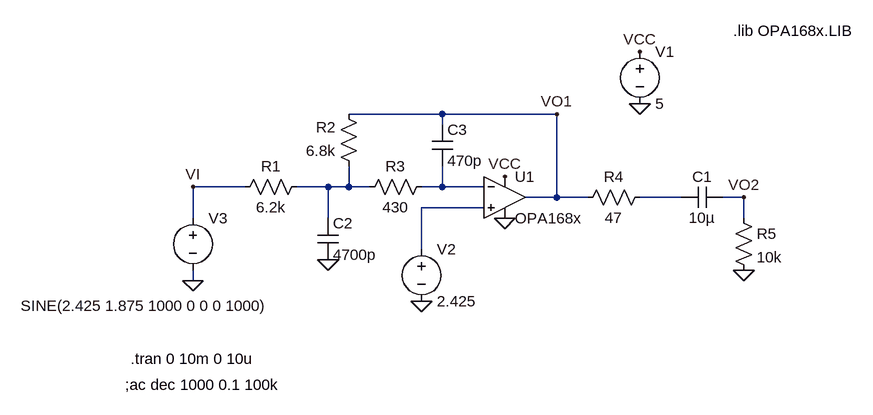
[diagram p0: schematic DACFilter.asc]
DACFilter.asc, the LTspice schematic file:
Version 4
SHEET 1 880 680
WIRE 112 32 -32 32
WIRE 288 32 112 32
WIRE 112 48 112 32
WIRE -192 144 -272 144
WIRE -64 144 -112 144
WIRE -32 144 -32 112
WIRE -32 144 -64 144
WIRE 0 144 -32 144
WIRE 112 144 112 112
WIRE 112 144 80 144
WIRE 176 144 112 144
WIRE 288 160 288 32
WIRE 288 160 240 160
WIRE 336 160 288 160
WIRE 480 160 416 160
WIRE 576 160 544 160
WIRE 176 176 80 176
WIRE -272 192 -272 144
WIRE -64 192 -64 144
WIRE 576 192 576 160
WIRE 80 240 80 176
WIRE -272 288 -272 272
FLAG 416 16 0
FLAG 416 -64 VCC
FLAG 208 128 VCC
FLAG 208 192 0
FLAG 80 320 0
FLAG 576 272 0
FLAG -272 288 0
FLAG -272 144 VI
FLAG -64 256 0
FLAG 288 32 VO1
FLAG 576 160 VO2
SYMBOL OpAmps\\opamp2 208 96 R0
SYMATTR InstName U1
SYMATTR Value OPA168x
SYMBOL voltage 416 -80 R0
WINDOW 123 0 0 Left 0
WINDOW 39 0 0 Left 0
SYMATTR InstName V1
SYMATTR Value 5
SYMBOL voltage 80 224 R0
WINDOW 123 0 0 Left 0
WINDOW 39 0 0 Left 0
SYMATTR InstName V2
SYMATTR Value 2.425
SYMBOL res -96 128 R90
WINDOW 0 0 56 VBottom 2
WINDOW 3 32 56 VTop 2
SYMATTR InstName R1
SYMATTR Value 6.2k
SYMBOL res -16 128 R180
WINDOW 0 36 76 Left 2
WINDOW 3 36 40 Left 2
SYMATTR InstName R2
SYMATTR Value 6.8k
SYMBOL res -16 160 R270
WINDOW 0 32 56 VTop 2
WINDOW 3 0 56 VBottom 2
SYMATTR InstName R3
SYMATTR Value 430
SYMBOL res 432 144 R90
WINDOW 0 0 56 VBottom 2
WINDOW 3 32 56 VTop 2
SYMATTR InstName R4
SYMATTR Value 47
SYMBOL cap 544 144 R90
WINDOW 0 0 32 VBottom 2
WINDOW 3 32 32 VTop 2
SYMATTR InstName C1
SYMATTR Value 10µ
SYMBOL res 560 176 R0
SYMATTR InstName R5
SYMATTR Value 10k
SYMBOL cap -80 192 R0
SYMATTR InstName C2
SYMATTR Value 4700p
SYMBOL cap 96 48 R0
SYMATTR InstName C3
SYMATTR Value 470p
SYMBOL voltage -272 176 R0
WINDOW 3 -265 151 Left 2
WINDOW 123 -97 56 Left 2
WINDOW 39 0 0 Left 0
SYMATTR Value SINE(2.425 1.875 1000 0 0 0 1000)
SYMATTR InstName V3
TEXT -368 408 Left 2 !.tran 0 10m 0 10u
TEXT 560 -96 Left 2 !.lib OPA168x.LIB
TEXT -376 448 Left 2 !;ac dec 1000 0.1 100k

The netlist it stands for:
* DACFilter.asc
XU1 N004 N002 VCC 0 VO1 OPA168x  ; pins In+ In- V+ V- OUT
V1 VCC 0 5
V2 N004 0 2.425
R1 N001 VI 6.2k
R2 N001 VO1 6.8k
R3 N001 N002 430
R4 N003 VO1 47
C1 VO2 N003 10µ
R5 VO2 0 10k
C2 N001 0 4700p
C3 VO1 N002 470p
V3 VI 0 SINE(2.425 1.875 1000 0 0 0 1000)
.tran 0 10m 0 10u
.lib OPA168x.LIB
;ac dec 1000 0.1 100k
.backanno
.end